# EAGLE schematic Plant Waterer (EAGLE 9.5.0)
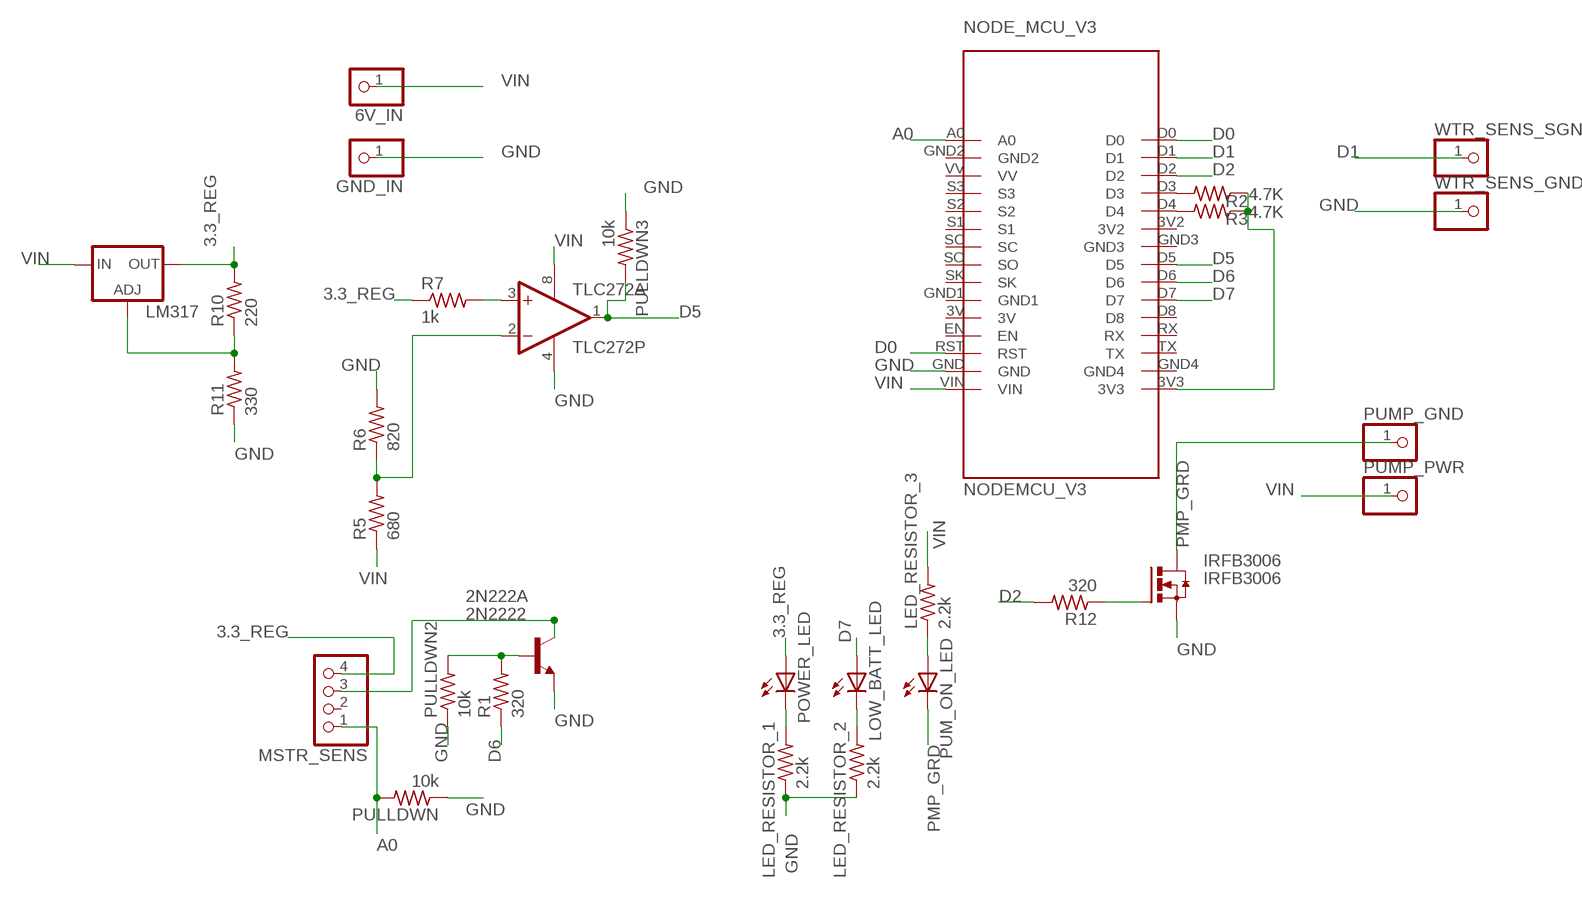
[diagram p0: schematic, sheet 1]

## Parts
2N222A  2N2222  [TO92-EBC-OVAL]
6V_IN  PINHD-1X1  [1X01]
GND_IN  PINHD-1X1  [1X01]
IRFB3006  IRFB3006  IRF3704L-V  [TO262-V]
LED_RESISTOR_1  2.2k  R-US_0207/10  [0207/10]
LED_RESISTOR_2  2.2k  R-US_0207/10  [0207/10]
LED_RESISTOR_3  2.2k  R-US_0207/10  [0207/10]
LM317  LM317TS  [317TS]
LOW_BATT_LED  LED5MM  [LED5MM]
MSTR_SENS  PINHD-1X4  [1X04]
NODE_MCU  NODEMCU_V3  [NODEMCU_V3]
POWER_LED  LED5MM  [LED5MM]
PULLDWN  10k  R-US_0207/10  [0207/10]
PULLDWN2  10k  R-US_0207/10  [0207/10]
PULLDWN3  10k  R-US_0207/10  [0207/10]
PUM_ON_LED  LED5MM  [LED5MM]
PUMP_GND  PINHD-1X1  [1X01]
PUMP_PWR  PINHD-1X1  [1X01]
R1  320  R-US_0207/10  [0207/10]
R2  4.7K  R-US_0207/10  [0207/10]
R3  4.7K  R-US_0207/10  [0207/10]
R5  680  R-US_0207/10  [0207/10]
R6  820  R-US_0207/10  [0207/10]
R7  1k  R-US_0207/10  [0207/10]
R10  220  R-US_0207/10  [0207/10]
R11  330  R-US_0207/10  [0207/10]
R12  320  R-US_0207/10  [0207/10]
TLC272  TLC272P  [DIL08]
WTR_SENS_GND  PINHD-1X1  [1X01]
WTR_SENS_SGNL  PINHD-1X1  [1X01]

## Nets
3.3_INTO_COMPARATOR [Signal]: R7.2 TLC272.3(A:+IN)
3.3_REG [Signal]: LM317.2(OUT) MSTR_SENS.4 POWER_LED.A R7.1 R10.2
A0 [Signal]: MSTR_SENS.1 NODE_MCU.A0 PULLDWN.2
D0 [Signal]: NODE_MCU.D0 NODE_MCU.RST
D1 [Signal]: NODE_MCU.D1 WTR_SENS_SGNL.1
D2 [Signal]: NODE_MCU.D2 R12.2
D5 [Signal]: NODE_MCU.D5 PULLDWN3.2 TLC272.1(A:OUT)
D6 [Signal]: NODE_MCU.D6 R1.1
D7 [Signal]: LOW_BATT_LED.A NODE_MCU.D7
GND [PWR]: 2N222A.E GND_IN.1 IRFB3006.3(S) LED_RESISTOR_1.1 LED_RESISTOR_2.1 NODE_MCU.GND PULLDWN2.1 PULLDWN3.1 PULLDWN.1 R6.2 R11.1 TLC272.4(P:V-) WTR_SENS_GND.1
LED_PWR [Signal]: LED_RESISTOR_1.2 POWER_LED.K(C)
LED_PWR2 [Signal]: LED_RESISTOR_2.2 LOW_BATT_LED.K(C)
LED_PWR3 [Signal]: LED_RESISTOR_3.1 PUM_ON_LED.A
LM317_ADJ [Signal]: LM317.1(ADJ) R10.1 R11.2
MOSFET_GATE [Signal]: IRFB3006.1(G) R12.1
N$1: NODE_MCU.D3 R2.2
N$2: NODE_MCU.D4 R3.2
N$3: NODE_MCU.3V3 R2.1 R3.1
PMP_GRD [PWR]: IRFB3006.2(D) PUM_ON_LED.K(C) PUMP_GND.1
PWR_TO_MSTR_SENS [Signal]: 2N222A.C MSTR_SENS.3
SIGNL_INTO_2N222A [Signal]: 2N222A.B PULLDWN2.2 R1.2
VIN [PWR]: 6V_IN.1 LED_RESISTOR_3.2 LM317.3(IN) NODE_MCU.VIN PUMP_PWR.1 R5.1 TLC272.8(P:V+)
VLTG_DIV_INTO_COMPARATOR [Signal]: R5.2 R6.1 TLC272.2(A:-IN)
Unconnected: MSTR_SENS.2 NODE_MCU.3V NODE_MCU.3V2 NODE_MCU.D8 NODE_MCU.EN NODE_MCU.GND1 NODE_MCU.GND2 NODE_MCU.GND3 NODE_MCU.GND4 NODE_MCU.RX NODE_MCU.S1 NODE_MCU.S2 NODE_MCU.S3 NODE_MCU.SC NODE_MCU.SK NODE_MCU.SO NODE_MCU.TX NODE_MCU.VV TLC272.5(B:+IN) TLC272.6(B:-IN) TLC272.7(B:OUT)

## Library data of the parts
2N222A = adafruit:2N2222: NPN TRANSISTOR Big oval pads
6V_IN GND_IN PUMP_GND PUMP_PWR WTR_SENS_GND WTR_SENS_SGNL = adafruit:PINHD-1X1: Pin header 1x1 for 0.1" spacing With round pins
IRFB3006 = transistor-power:IRF3704: SMPS MOSFET HEXFET® Power MOSFET Source: http://www.irf.com/product-info/datasheets/data/irf3704.pdf
LED_RESISTOR_1-LED_RESISTOR_3 PULLDWN PULLDWN2 PULLDWN3 R1-R3 R5-R7 R10-R12 = adafruit:R-US_: RESISTOR, American symbol
LM317 = v-reg:LM317TS: VOLTAGE REGULATOR
LOW_BATT_LED POWER_LED PUM_ON_LED = adafruit:LED: LED OSRAM: - CHIPLED LG R971, LG N971, LY N971, LG Q971, LY Q971, LO R971, LY R971 LH N974, LH R974 LS Q976, LO Q976, LY Q976 LO Q996 - Hyper CHIPLED LW Q18S LB Q993, LB Q99A, LB R99A - SideLED LS A670, LO A670, LY A670, LG A670, LP A670 LB A673, LV A673, LT A673, LW A673 LH A674 LY A675 LS A676, LA A676, LO A676, LY A676, LW A676 LS A679, LY A679, LG A679 - Hyper Micro SIDELED® LS Y876, LA Y876, LO Y876, LY Y876 LT Y87S - SmartLED LW L88C, LW L88S LB L89C, LB L89S, LG L890 LS L89K, LO L89K, LY L89K LS L896, LA L896, LO L896, LY L896 - TOPLED LS T670, LO T670, LY T670, LG T670, LP T670 LSG T670, LSP T670, LSY T670, LOP T670, LYG T670 LG T671, LOG T671, LSG T671 LB T673, LV T673, LT T673, LW T673 LH T674 LS T676, LA T676, LO T676, LY T676, LB T676, LH T676, LSB T676, LW T676 LB T67C, LV T67C, LT T67C, LS T67K, LO T67K, LY T67K, LW E67C LS E67B, LA E67B, LO E67B, LY E67B, LB E67C, LV E67C, LT E67C LW T67C LS T679, LY T679, LG T679 LS T770, LO T770, LY T770, LG T770, LP T770 LB T773, LV T773, LT T773, LW T773 LH T774 LS E675, LA E675, LY E675, LS T675 LS T776, LA T776, LO T776, LY T776, LB T776 LHGB T686 LT T68C, LB T68C - Hyper Mini TOPLED® LB M676 - Mini TOPLED Santana® LG M470 LS M47K, LO M47K, LY M47K Source: http://www.osram.convergy.de/
MSTR_SENS = pinhead:PINHD-1X4: PIN HEADER
NODE_MCU = My library:NODEMCU_V3
TLC272 = linear:TLC272: OP AMP

## Net classes
1 PWR: width 0.406 mm
2 Signal: width 0.254 mm